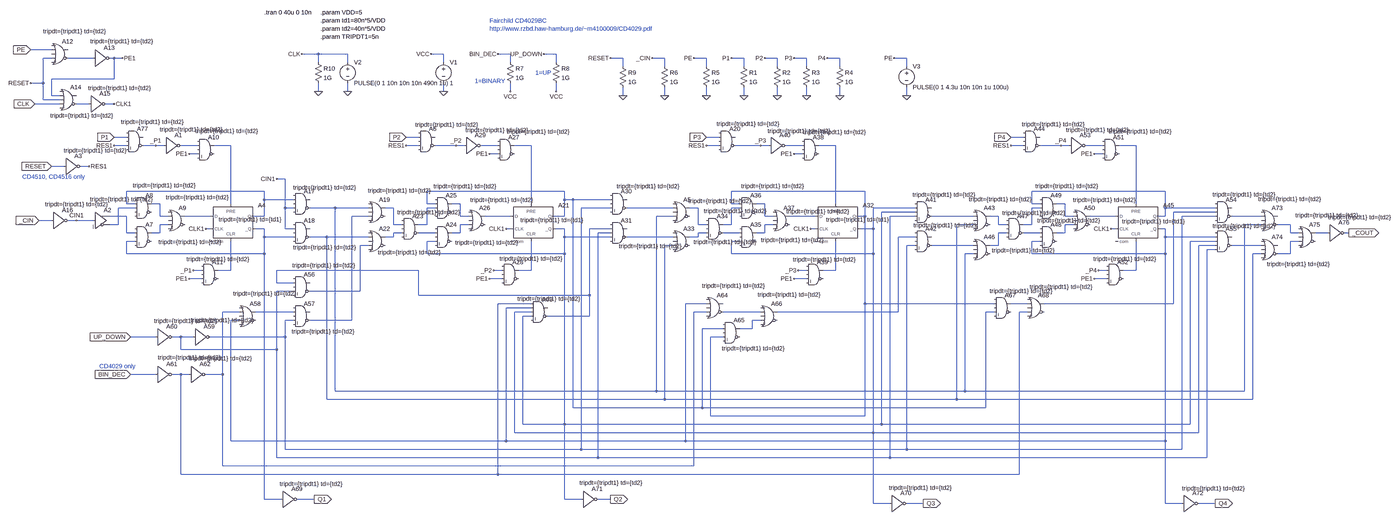
[diagram p0: schematic CD4029B_Hier_Tst_solo.asc, whole sheet]
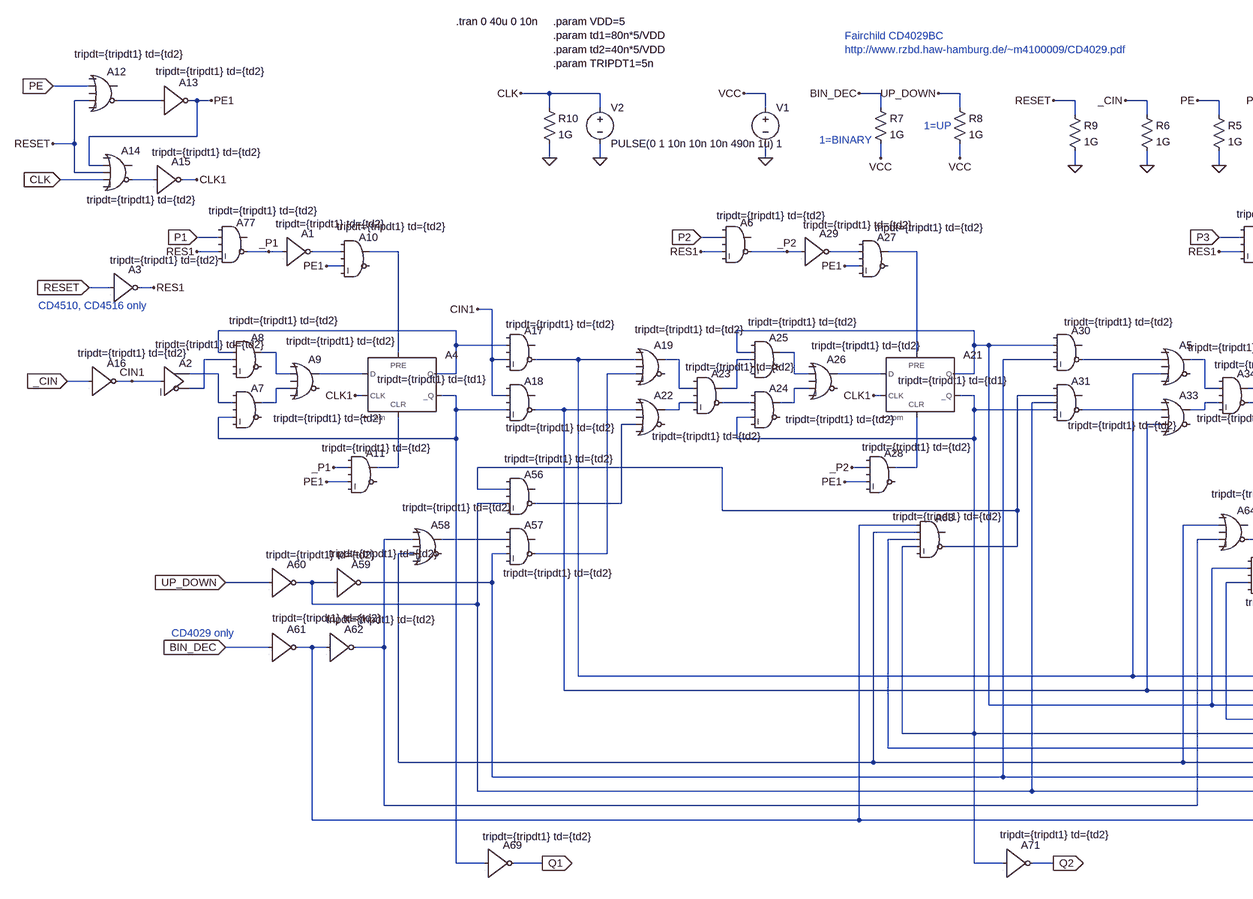
[diagram p1: schematic CD4029B_Hier_Tst_solo.asc, part, row 1 of 1, column 1 of 2]
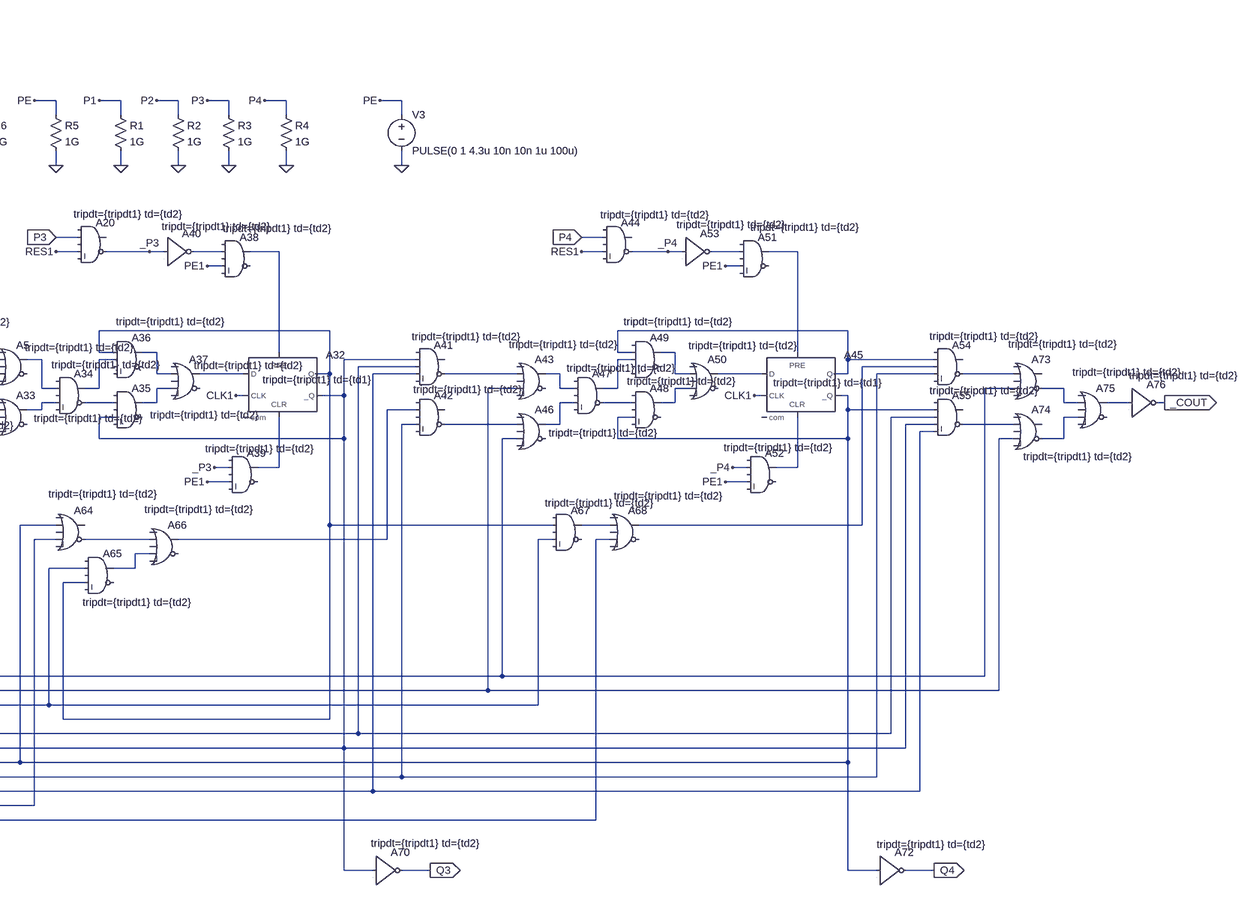
[diagram p2: schematic CD4029B_Hier_Tst_solo.asc, part, row 1 of 1, column 2 of 2]
CD4029B_Hier_Tst_solo.asc, the LTspice schematic file:
Version 4
SHEET 1 5108 1400
WIRE -64 -416 -144 -416
WIRE 960 -400 896 -400
WIRE 1072 -400 960 -400
WIRE 1440 -400 1392 -400
WIRE 1696 -400 1648 -400
WIRE 1872 -400 1824 -400
WIRE -64 -384 -96 -384
WIRE 96 -384 0 -384
WIRE 176 -384 160 -384
WIRE 208 -384 176 -384
WIRE 2128 -384 2080 -384
WIRE 2288 -384 2240 -384
WIRE 2448 -384 2400 -384
WIRE 2592 -384 2544 -384
WIRE 2720 -384 2672 -384
WIRE 2832 -384 2784 -384
WIRE 2960 -384 2912 -384
WIRE 3216 -384 3168 -384
WIRE 960 -368 960 -400
WIRE 1072 -368 1072 -400
WIRE 1440 -368 1440 -400
WIRE 1696 -368 1696 -400
WIRE 1872 -368 1872 -400
WIRE 2128 -352 2128 -384
WIRE 2288 -352 2288 -384
WIRE 2448 -352 2448 -384
WIRE 2592 -352 2592 -384
WIRE 2720 -352 2720 -384
WIRE 2832 -352 2832 -384
WIRE 2960 -352 2960 -384
WIRE 3216 -352 3216 -384
WIRE 176 -304 176 -384
WIRE 176 -304 -64 -304
WIRE -96 -288 -96 -384
WIRE -96 -288 -144 -288
WIRE 960 -256 960 -288
WIRE 1072 -256 1072 -288
WIRE 1440 -256 1440 -288
WIRE 1696 -256 1696 -288
WIRE 1872 -256 1872 -288
WIRE -64 -240 -64 -304
WIRE -32 -240 -64 -240
WIRE 2128 -240 2128 -272
WIRE 2288 -240 2288 -272
WIRE 2448 -240 2448 -272
WIRE 2592 -240 2592 -272
WIRE 2720 -240 2720 -272
WIRE 2832 -240 2832 -272
WIRE 2960 -240 2960 -272
WIRE 3216 -240 3216 -272
WIRE -96 -224 -96 -288
WIRE -32 -224 -96 -224
WIRE -32 -208 -128 -208
WIRE 80 -208 32 -208
WIRE 176 -208 144 -208
WIRE 224 -80 176 -80
WIRE 1344 -80 1296 -80
WIRE 2496 -80 2448 -80
WIRE 3664 -80 3616 -80
WIRE 224 -48 176 -48
WIRE 336 -48 288 -48
WIRE 368 -48 336 -48
WIRE 496 -48 432 -48
WIRE 624 -48 560 -48
WIRE 1344 -48 1296 -48
WIRE 1488 -48 1408 -48
WIRE 1520 -48 1488 -48
WIRE 1648 -48 1584 -48
WIRE 1776 -48 1712 -48
WIRE 2496 -48 2448 -48
WIRE 2656 -48 2560 -48
WIRE 2688 -48 2656 -48
WIRE 2816 -48 2752 -48
WIRE 2944 -48 2880 -48
WIRE 3664 -48 3616 -48
WIRE 3808 -48 3728 -48
WIRE 3840 -48 3808 -48
WIRE 3968 -48 3904 -48
WIRE 4096 -48 4032 -48
WIRE 496 -16 464 -16
WIRE 1648 -16 1616 -16
WIRE 2816 -16 2784 -16
WIRE 3968 -16 3936 -16
WIRE -16 32 -64 32
WIRE 80 32 48 32
WIRE 832 80 800 80
WIRE 752 128 224 128
WIRE 1904 128 1376 128
WIRE 3056 128 2544 128
WIRE 4208 128 3696 128
WIRE 752 160 752 128
WIRE 864 160 752 160
WIRE 1904 160 1904 128
WIRE 1936 160 1904 160
WIRE 2080 160 1936 160
WIRE 224 176 224 128
WIRE 256 176 224 176
WIRE 352 176 320 176
WIRE 624 176 624 -48
WIRE 1376 176 1376 128
WIRE 1408 176 1376 176
WIRE 1504 176 1472 176
WIRE 1776 176 1776 -48
WIRE 2544 176 2544 128
WIRE 2576 176 2544 176
WIRE 2672 176 2640 176
WIRE 2944 176 2944 -48
WIRE 3696 176 3696 128
WIRE 3728 176 3696 176
WIRE 3824 176 3792 176
WIRE 4096 176 4096 -48
WIRE 256 192 192 192
WIRE 832 192 832 80
WIRE 864 192 832 192
WIRE 1024 192 928 192
WIRE 1152 192 1024 192
WIRE 1248 192 1216 192
WIRE 1408 192 1376 192
WIRE 2080 192 1968 192
WIRE 2320 192 2144 192
WIRE 2416 192 2384 192
WIRE 2576 192 2544 192
WIRE 3248 192 3088 192
WIRE 3728 192 3696 192
WIRE 4208 192 4208 128
WIRE 4400 192 4208 192
WIRE 3248 208 3120 208
WIRE 4400 208 4240 208
WIRE 224 224 160 224
WIRE 352 224 352 176
WIRE 384 224 352 224
WIRE 544 224 448 224
WIRE 752 224 752 160
WIRE 752 224 704 224
WIRE 1152 224 1088 224
WIRE 1504 224 1504 176
WIRE 1536 224 1504 224
WIRE 1696 224 1600 224
WIRE 1904 224 1904 160
WIRE 1904 224 1856 224
WIRE 2320 224 2256 224
WIRE 2672 224 2672 176
WIRE 2704 224 2672 224
WIRE 2864 224 2768 224
WIRE 3056 224 3056 128
WIRE 3056 224 3024 224
WIRE 3248 224 3152 224
WIRE 3472 224 3312 224
WIRE 3568 224 3536 224
WIRE 3824 224 3824 176
WIRE 3856 224 3824 224
WIRE 4016 224 3920 224
WIRE 4208 224 4208 192
WIRE 4208 224 4176 224
WIRE 4400 224 4272 224
WIRE 4576 224 4464 224
WIRE -64 240 -112 240
WIRE 32 240 0 240
WIRE 96 240 32 240
WIRE 192 256 192 192
WIRE 192 256 160 256
WIRE 384 256 352 256
WIRE 1248 256 1248 192
WIRE 1280 256 1248 256
WIRE 1376 256 1376 192
WIRE 1376 256 1344 256
WIRE 1536 256 1504 256
WIRE 2416 256 2416 192
WIRE 2448 256 2416 256
WIRE 2544 256 2544 192
WIRE 2544 256 2512 256
WIRE 2704 256 2672 256
WIRE 3472 256 3408 256
WIRE 3568 256 3568 224
WIRE 3600 256 3568 256
WIRE 3696 256 3696 192
WIRE 3696 256 3664 256
WIRE 3856 256 3824 256
WIRE 4576 256 4512 256
WIRE 4688 256 4640 256
WIRE 544 272 528 272
WIRE 752 272 720 272
WIRE 832 272 832 192
WIRE 864 272 832 272
WIRE 1696 272 1680 272
WIRE 1904 272 1872 272
WIRE 2080 272 2000 272
WIRE 2864 272 2848 272
WIRE 3088 272 3088 192
WIRE 3088 272 3040 272
WIRE 4016 272 4000 272
WIRE 4208 272 4192 272
WIRE 224 288 224 224
WIRE 256 288 224 288
WIRE 352 288 352 256
WIRE 352 288 320 288
WIRE 1280 288 1248 288
WIRE 1408 288 1344 288
WIRE 1504 288 1504 256
WIRE 1504 288 1472 288
WIRE 2080 288 2032 288
WIRE 2448 288 2416 288
WIRE 2576 288 2512 288
WIRE 2672 288 2672 256
WIRE 2672 288 2640 288
WIRE 3600 288 3568 288
WIRE 3728 288 3664 288
WIRE 3824 288 3824 256
WIRE 3824 288 3792 288
WIRE 4688 288 4688 256
WIRE 4720 288 4688 288
WIRE 4832 288 4784 288
WIRE 4912 288 4896 288
WIRE 752 304 752 272
WIRE 864 304 752 304
WIRE 992 304 928 304
WIRE 1152 304 992 304
WIRE 1248 304 1248 288
WIRE 1248 304 1216 304
WIRE 1904 304 1904 272
WIRE 2080 304 1904 304
WIRE 2320 304 2144 304
WIRE 2416 304 2416 288
WIRE 2416 304 2384 304
WIRE 3248 304 3184 304
WIRE 4208 304 4208 272
WIRE 4400 304 4208 304
WIRE 256 320 224 320
WIRE 1408 320 1376 320
WIRE 2576 320 2544 320
WIRE 3728 320 3696 320
WIRE 4400 320 4304 320
WIRE 4720 320 4688 320
WIRE 1152 336 1120 336
WIRE 2320 336 2288 336
WIRE 3248 336 3216 336
WIRE 3472 336 3312 336
WIRE 3568 336 3568 288
WIRE 3568 336 3536 336
WIRE 4400 336 4336 336
WIRE 4576 336 4464 336
WIRE 4400 352 4368 352
WIRE 224 368 224 320
WIRE 752 368 752 304
WIRE 752 368 224 368
WIRE 1376 368 1376 320
WIRE 1904 368 1904 304
WIRE 1904 368 1376 368
WIRE 2544 368 2544 320
WIRE 3088 368 3088 272
WIRE 3088 368 2544 368
WIRE 3472 368 3440 368
WIRE 3696 368 3696 320
WIRE 4208 368 4208 304
WIRE 4208 368 3696 368
WIRE 4576 368 4544 368
WIRE 4688 368 4688 320
WIRE 4688 368 4640 368
WIRE 512 432 480 432
WIRE 624 432 624 320
WIRE 624 432 576 432
WIRE 1344 432 800 432
WIRE 1664 432 1632 432
WIRE 1776 432 1776 320
WIRE 1776 432 1728 432
WIRE 2832 432 2800 432
WIRE 2944 432 2944 320
WIRE 2944 432 2896 432
WIRE 3984 432 3952 432
WIRE 4096 432 4096 320
WIRE 4096 432 4048 432
WIRE 512 464 464 464
WIRE 1664 464 1616 464
WIRE 2832 464 2784 464
WIRE 3984 464 3936 464
WIRE 800 480 800 432
WIRE 864 480 800 480
WIRE 864 512 800 512
WIRE 1120 512 1120 336
WIRE 1120 512 928 512
WIRE 1344 528 1344 432
WIRE 2000 528 2000 272
WIRE 2000 528 1344 528
WIRE 1776 560 1648 560
WIRE 2448 560 2368 560
WIRE 3056 560 3056 224
WIRE 3552 560 3056 560
WIRE 3680 560 3616 560
WIRE 4240 560 4240 208
WIRE 4240 560 3744 560
WIRE 1776 576 1680 576
WIRE 656 592 592 592
WIRE 864 592 720 592
WIRE 1776 592 1712 592
WIRE 2448 592 2400 592
WIRE 2656 592 2512 592
WIRE 3184 592 3184 304
WIRE 3184 592 2720 592
WIRE 3552 592 3520 592
WIRE 3680 592 3648 592
WIRE 1776 608 1744 608
WIRE 2000 608 2000 528
WIRE 2000 608 1840 608
WIRE 656 624 624 624
WIRE 864 624 832 624
WIRE 1088 624 1088 224
WIRE 1088 624 928 624
WIRE 2656 624 2624 624
WIRE 2512 656 2432 656
WIRE 2624 656 2624 624
WIRE 2624 656 2576 656
WIRE 336 688 240 688
WIRE 432 688 400 688
WIRE 480 688 432 688
WIRE 832 688 832 624
WIRE 832 688 544 688
WIRE 2512 688 2464 688
WIRE 432 736 432 688
WIRE 800 736 800 512
WIRE 800 736 432 736
WIRE 336 832 240 832
WIRE 432 832 400 832
WIRE 464 832 432 832
WIRE 592 832 592 592
WIRE 592 832 528 832
WIRE 1024 896 1024 192
WIRE 2256 896 2256 224
WIRE 2256 896 1024 896
WIRE 3440 896 3440 368
WIRE 3440 896 2256 896
WIRE 4512 896 4512 256
WIRE 4512 896 3440 896
WIRE 992 928 992 304
WIRE 2288 928 2288 336
WIRE 2288 928 992 928
WIRE 3408 928 3408 256
WIRE 3408 928 2288 928
WIRE 4544 928 4544 368
WIRE 4544 928 3408 928
WIRE 1936 960 1936 160
WIRE 2432 960 2432 656
WIRE 2432 960 1936 960
WIRE 3520 960 3520 592
WIRE 3520 960 2432 960
WIRE 2464 992 2464 688
WIRE 3056 992 3056 560
WIRE 3056 992 2464 992
WIRE 1744 1024 1744 608
WIRE 1904 1024 1904 368
WIRE 1904 1024 1744 1024
WIRE 3120 1024 3120 208
WIRE 3120 1024 1904 1024
WIRE 4304 1024 4304 320
WIRE 4304 1024 3120 1024
WIRE 1712 1056 1712 592
WIRE 3088 1056 3088 368
WIRE 3088 1056 1712 1056
WIRE 4336 1056 4336 336
WIRE 4336 1056 3088 1056
WIRE 624 1088 624 624
WIRE 1680 1088 1680 576
WIRE 1680 1088 624 1088
WIRE 2368 1088 2368 560
WIRE 2368 1088 1680 1088
WIRE 4208 1088 4208 368
WIRE 4208 1088 2368 1088
WIRE 832 1120 832 688
WIRE 1968 1120 1968 192
WIRE 1968 1120 832 1120
WIRE 3216 1120 3216 336
WIRE 3216 1120 1968 1120
WIRE 4272 1120 4272 224
WIRE 4272 1120 3216 1120
WIRE 800 1152 800 736
WIRE 2032 1152 2032 288
WIRE 2032 1152 800 1152
WIRE 3152 1152 3152 224
WIRE 3152 1152 2032 1152
WIRE 4368 1152 4368 352
WIRE 4368 1152 3152 1152
WIRE 592 1184 592 832
WIRE 2400 1184 2400 592
WIRE 2400 1184 592 1184
WIRE 432 1216 432 832
WIRE 1648 1216 1648 560
WIRE 1648 1216 432 1216
WIRE 3648 1216 3648 592
WIRE 3648 1216 1648 1216
WIRE 752 1312 752 368
WIRE 816 1312 752 1312
WIRE 944 1312 880 1312
WIRE 1904 1312 1904 1024
WIRE 1968 1312 1904 1312
WIRE 2080 1312 2032 1312
WIRE 3088 1328 3088 1056
WIRE 3152 1328 3088 1328
WIRE 3280 1328 3216 1328
WIRE 4208 1328 4208 1088
WIRE 4272 1328 4208 1328
WIRE 4400 1328 4336 1328
FLAG 176 -80 P1
IOPIN 176 -80 In
FLAG 336 -48 _P1
FLAG -144 -416 PE
IOPIN -144 -416 In
FLAG 464 -16 PE1
FLAG 464 464 PE1
FLAG 480 432 _P1
FLAG -128 -208 CLK
IOPIN -128 -208 In
FLAG 528 272 CLK1
FLAG 176 -208 CLK1
FLAG -112 240 _CIN
IOPIN -112 240 In
FLAG 32 240 CIN1
FLAG 800 80 CIN1
FLAG 1296 -80 P2
IOPIN 1296 -80 In
FLAG 1488 -48 _P2
FLAG 1616 -16 PE1
FLAG 1616 464 PE1
FLAG 1632 432 _P2
FLAG 1680 272 CLK1
FLAG 208 -384 PE1
FLAG 2448 -80 P3
IOPIN 2448 -80 In
FLAG 2656 -48 _P3
FLAG 2784 -16 PE1
FLAG 2784 464 PE1
FLAG 2800 432 _P3
FLAG 2848 272 CLK1
FLAG 3616 -80 P4
IOPIN 3616 -80 In
FLAG 3808 -48 _P4
FLAG 3936 -16 PE1
FLAG 3936 464 PE1
FLAG 3952 432 _P4
FLAG 4000 272 CLK1
FLAG 240 688 UP_DOWN
IOPIN 240 688 In
FLAG 240 832 BIN_DEC
IOPIN 240 832 In
FLAG 944 1312 Q1
IOPIN 944 1312 Out
FLAG 2080 1312 Q2
IOPIN 2080 1312 Out
FLAG 3280 1328 Q3
IOPIN 3280 1328 Out
FLAG 4400 1328 Q4
IOPIN 4400 1328 Out
FLAG 4912 288 _COUT
IOPIN 4912 288 Out
FLAG 2960 -240 0
FLAG 2832 -240 0
FLAG 2720 -240 0
FLAG 2592 -240 0
FLAG 2544 -384 P1
FLAG 2672 -384 P2
FLAG 2784 -384 P3
FLAG 2912 -384 P4
FLAG 2448 -240 0
FLAG 2400 -384 PE
FLAG 2288 -240 0
FLAG 2240 -384 _CIN
FLAG 1648 -400 BIN_DEC
FLAG 1392 -400 VCC
FLAG 1440 -256 0
FLAG 1072 -256 0
FLAG 896 -400 CLK
FLAG 1824 -400 UP_DOWN
FLAG 1696 -256 VCC
FLAG 1872 -256 VCC
FLAG 3216 -240 0
FLAG 3168 -384 PE
FLAG -144 -288 RESET
FLAG 80 32 RES1
FLAG -64 32 RESET
IOPIN -64 32 In
FLAG 176 -48 RES1
FLAG 1296 -48 RES1
FLAG 2448 -48 RES1
FLAG 3616 -48 RES1
FLAG 2128 -240 0
FLAG 2080 -384 RESET
FLAG 960 -256 0
SYMBOL Digital\\dflop 624 176 R0
WINDOW 123 -47 60 Left 0
SYMATTR Value2 tripdt={tripdt1} td={td1}
SYMATTR InstName A4
SYMBOL Digital\\and 288 240 R0
WINDOW 123 58 83 Left 0
SYMATTR Value2 tripdt={tripdt1} td={td2}
SYMATTR InstName A7
SYMBOL Digital\\and 288 128 R0
WINDOW 123 -40 -23 Left 0
SYMATTR Value2 tripdt={tripdt1} td={td2}
SYMATTR InstName A8
SYMBOL Digital\\or 416 176 R0
WINDOW 123 -41 -25 Left 0
SYMATTR Value2 tripdt={tripdt1} td={td2}
SYMATTR InstName A9
SYMBOL Digital\\and 528 -96 R0
WINDOW 123 -41 -8 Left 0
SYMATTR Value2 tripdt={tripdt1} td={td2}
SYMATTR InstName A10
SYMBOL Digital\\and 544 384 R0
WINDOW 123 -90 5 Left 0
SYMATTR Value2 tripdt={tripdt1} td={td2}
SYMATTR InstName A11
SYMBOL Digital\\inv 368 -112 R0
WINDOW 123 -17 2 Left 0
SYMATTR Value2 tripdt={tripdt1} td={td2}
SYMATTR InstName A1
SYMBOL Digital\\inv 96 -448 R0
WINDOW 123 -11 -1 Left 0
SYMATTR Value2 tripdt={tripdt1} td={td2}
SYMATTR InstName A13
SYMBOL Digital\\or 0 -288 R0
WINDOW 123 -69 125 Left 0
SYMATTR Value2 tripdt={tripdt1} td={td2}
SYMATTR InstName A14
SYMBOL Digital\\inv 80 -272 R0
WINDOW 123 -4 3 Left 0
SYMATTR Value2 tripdt={tripdt1} td={td2}
SYMATTR InstName A15
SYMBOL Digital\\inv -64 176 R0
WINDOW 123 -25 2 Left 0
SYMATTR Value2 tripdt={tripdt1} td={td2}
SYMATTR InstName A16
SYMBOL Digital\\and 896 112 R0
WINDOW 123 -33 2 Left 0
SYMATTR Value2 tripdt={tripdt1} td={td2}
SYMATTR InstName A17
SYMBOL Digital\\and 896 224 R0
WINDOW 123 -33 120 Left 0
SYMATTR Value2 tripdt={tripdt1} td={td2}
SYMATTR InstName A18
SYMBOL Digital\\or 1184 144 R0
WINDOW 123 -34 -19 Left 0
SYMATTR Value2 tripdt={tripdt1} td={td2}
SYMATTR InstName A19
SYMBOL Digital\\dflop 1776 176 R0
WINDOW 123 -41 63 Left 0
SYMATTR Value2 tripdt={tripdt1} td={td1}
SYMATTR InstName A21
SYMBOL Digital\\or 1184 256 R0
WINDOW 123 4 107 Left 0
SYMATTR Value2 tripdt={tripdt1} td={td2}
SYMATTR InstName A22
SYMBOL Digital\\and 1312 208 R0
WINDOW 123 -50 1 Left 0
SYMATTR Value2 tripdt={tripdt1} td={td2}
SYMATTR InstName A23
SYMBOL Digital\\and 1440 240 R0
WINDOW 123 45 85 Left 0
SYMATTR Value2 tripdt={tripdt1} td={td2}
SYMATTR InstName A24
SYMBOL Digital\\and 1440 128 R0
WINDOW 123 -39 -19 Left 0
SYMATTR Value2 tripdt={tripdt1} td={td2}
SYMATTR InstName A25
SYMBOL Digital\\or 1568 176 R0
WINDOW 123 -26 -15 Left 0
SYMATTR Value2 tripdt={tripdt1} td={td2}
SYMATTR InstName A26
SYMBOL Digital\\and 1680 -96 R0
WINDOW 123 2 -5 Left 0
SYMATTR Value2 tripdt={tripdt1} td={td2}
SYMATTR InstName A27
SYMBOL Digital\\and 1696 384 R0
WINDOW 123 -41 3 Left 0
SYMATTR Value2 tripdt={tripdt1} td={td2}
SYMATTR InstName A28
SYMBOL Digital\\inv 1520 -112 R0
WINDOW 123 4 5 Left 0
SYMATTR Value2 tripdt={tripdt1} td={td2}
SYMATTR InstName A29
SYMBOL Digital\\and 2112 112 R0
WINDOW 123 -8 -3 Left 0
SYMATTR Value2 tripdt={tripdt1} td={td2}
SYMATTR InstName A30
SYMBOL Digital\\and 2112 224 R0
WINDOW 123 0 115 Left 0
SYMATTR Value2 tripdt={tripdt1} td={td2}
SYMATTR InstName A31
SYMBOL Digital\\buf 96 176 R0
WINDOW 123 -12 -17 Left 0
SYMATTR Value2 tripdt={tripdt1} td={td2}
SYMATTR InstName A2
SYMBOL Digital\\or 2352 144 R0
WINDOW 123 27 21 Left 0
SYMATTR Value2 tripdt={tripdt1} td={td2}
SYMATTR InstName A5
SYMBOL Digital\\dflop 2944 176 R0
WINDOW 123 -37 61 Left 0
SYMATTR Value2 tripdt={tripdt1} td={td1}
SYMATTR InstName A32
SYMBOL Digital\\or 2352 256 R0
WINDOW 123 47 67 Left 0
SYMATTR Value2 tripdt={tripdt1} td={td2}
SYMATTR InstName A33
SYMBOL Digital\\and 2480 208 R0
WINDOW 123 -42 -4 Left 0
SYMATTR Value2 tripdt={tripdt1} td={td2}
SYMATTR InstName A34
SYMBOL Digital\\and 2608 240 R0
WINDOW 123 49 75 Left 0
SYMATTR Value2 tripdt={tripdt1} td={td2}
SYMATTR InstName A35
SYMBOL Digital\\and 2608 128 R0
WINDOW 123 -27 -20 Left 0
SYMATTR Value2 tripdt={tripdt1} td={td2}
SYMATTR InstName A36
SYMBOL Digital\\or 2736 176 R0
WINDOW 123 19 29 Left 0
SYMATTR Value2 tripdt={tripdt1} td={td2}
SYMATTR InstName A37
SYMBOL Digital\\and 2848 -96 R0
WINDOW 123 -29 -4 Left 0
SYMATTR Value2 tripdt={tripdt1} td={td2}
SYMATTR InstName A38
SYMBOL Digital\\and 2864 384 R0
WINDOW 123 -84 6 Left 0
SYMATTR Value2 tripdt={tripdt1} td={td2}
SYMATTR InstName A39
SYMBOL Digital\\inv 2688 -112 R0
WINDOW 123 -5 8 Left 0
SYMATTR Value2 tripdt={tripdt1} td={td2}
SYMATTR InstName A40
SYMBOL Digital\\and 3280 144 R0
WINDOW 123 -41 -3 Left 0
SYMATTR Value2 tripdt={tripdt1} td={td2}
SYMATTR InstName A41
SYMBOL Digital\\and 3280 256 R0
WINDOW 123 -38 3 Left 0
SYMATTR Value2 tripdt={tripdt1} td={td2}
SYMATTR InstName A42
SYMBOL Digital\\or 3504 176 R0
WINDOW 123 -49 -17 Left 0
SYMATTR Value2 tripdt={tripdt1} td={td2}
SYMATTR InstName A43
SYMBOL Digital\\dflop 4096 176 R0
WINDOW 123 -54 68 Left 0
SYMATTR Value2 tripdt={tripdt1} td={td1}
SYMATTR InstName A45
SYMBOL Digital\\or 3504 288 R0
WINDOW 123 39 67 Left 0
SYMATTR Value2 tripdt={tripdt1} td={td2}
SYMATTR InstName A46
SYMBOL Digital\\and 3632 208 R0
WINDOW 123 -49 3 Left 0
SYMATTR Value2 tripdt={tripdt1} td={td2}
SYMATTR InstName A47
SYMBOL Digital\\and 3760 240 R0
WINDOW 123 -43 0 Left 0
SYMATTR Value2 tripdt={tripdt1} td={td2}
SYMATTR InstName A48
SYMBOL Digital\\and 3760 128 R0
WINDOW 123 -50 -20 Left 0
SYMATTR Value2 tripdt={tripdt1} td={td2}
SYMATTR InstName A49
SYMBOL Digital\\or 3888 176 R0
WINDOW 123 -34 -15 Left 0
SYMATTR Value2 tripdt={tripdt1} td={td2}
SYMATTR InstName A50
SYMBOL Digital\\and 4000 -96 R0
WINDOW 123 -9 -6 Left 0
SYMATTR Value2 tripdt={tripdt1} td={td2}
SYMATTR InstName A51
SYMBOL Digital\\and 4016 384 R0
WINDOW 123 -84 4 Left 0
SYMATTR Value2 tripdt={tripdt1} td={td2}
SYMATTR InstName A52
SYMBOL Digital\\inv 3840 -112 R0
WINDOW 123 -13 4 Left 0
SYMATTR Value2 tripdt={tripdt1} td={td2}
SYMATTR InstName A53
SYMBOL Digital\\and 4432 144 R0
WINDOW 123 -42 -4 Left 0
SYMATTR Value2 tripdt={tripdt1} td={td2}
SYMATTR InstName A54
SYMBOL Digital\\and 4432 256 R0
WINDOW 123 -42 5 Left 0
SYMATTR Value2 tripdt={tripdt1} td={td2}
SYMATTR InstName A55
SYMBOL Digital\\and 896 432 R0
WINDOW 123 -36 -19 Left 0
SYMATTR Value2 tripdt={tripdt1} td={td2}
SYMATTR InstName A56
SYMBOL Digital\\and 896 544 R0
WINDOW 123 -39 123 Left 0
SYMATTR Value2 tripdt={tripdt1} td={td2}
SYMATTR InstName A57
SYMBOL Digital\\or 688 544 R0
WINDOW 123 -55 -23 Left 0
SYMATTR Value2 tripdt={tripdt1} td={td2}
SYMATTR InstName A58
SYMBOL Digital\\inv 480 624 R0
WINDOW 123 -10 0 Left 0
SYMATTR Value2 tripdt={tripdt1} td={td2}
SYMATTR InstName A59
SYMBOL Digital\\inv 336 624 R0
WINDOW 123 -6 2 Left 0
SYMATTR Value2 tripdt={tripdt1} td={td2}
SYMATTR InstName A60
SYMBOL Digital\\inv 336 768 R0
WINDOW 123 8 -1 Left 0
SYMATTR Value2 tripdt={tripdt1} td={td2}
SYMATTR InstName A61
SYMBOL Digital\\inv 464 768 R0
WINDOW 123 0 2 Left 0
SYMATTR Value2 tripdt={tripdt1} td={td2}
SYMATTR InstName A62
SYMBOL Digital\\and 1808 528 R0
WINDOW 123 -85 13 Left 0
SYMATTR Value2 tripdt={tripdt1} td={td2}
SYMATTR InstName A63
SYMBOL Digital\\or 2480 512 R0
WINDOW 123 -49 -21 Left 0
SYMATTR Value2 tripdt={tripdt1} td={td2}
SYMATTR InstName A64
SYMBOL Digital\\and 2544 608 R0
WINDOW 123 -37 124 Left 0
SYMATTR Value2 tripdt={tripdt1} td={td2}
SYMATTR InstName A65
SYMBOL Digital\\or 2688 544 R0
WINDOW 123 -43 -19 Left 0
SYMATTR Value2 tripdt={tripdt1} td={td2}
SYMATTR InstName A66
SYMBOL Digital\\and 3584 512 R0
WINDOW 123 -49 -1 Left 0
SYMATTR Value2 tripdt={tripdt1} td={td2}
SYMATTR InstName A67
SYMBOL Digital\\or 3712 512 R0
WINDOW 123 -24 -17 Left 0
SYMATTR Value2 tripdt={tripdt1} td={td2}
SYMATTR InstName A68
SYMBOL Digital\\inv 816 1248 R0
WINDOW 123 -5 5 Left 0
SYMATTR Value2 tripdt={tripdt1} td={td2}
SYMATTR InstName A69
SYMBOL Digital\\inv 3152 1264 R0
WINDOW 123 -4 4 Left 0
SYMATTR Value2 tripdt={tripdt1} td={td2}
SYMATTR InstName A70
SYMBOL Digital\\inv 1968 1248 R0
WINDOW 123 -7 1 Left 0
SYMATTR Value2 tripdt={tripdt1} td={td2}
SYMATTR InstName A71
SYMBOL Digital\\inv 4272 1264 R0
WINDOW 123 0 6 Left 0
SYMATTR Value2 tripdt={tripdt1} td={td2}
SYMATTR InstName A72
SYMBOL Digital\\or 4608 176 R0
WINDOW 123 -43 -18 Left 0
SYMATTR Value2 tripdt={tripdt1} td={td2}
SYMATTR InstName A73
SYMBOL Digital\\or 4608 288 R0
WINDOW 123 -10 120 Left 0
SYMATTR Value2 tripdt={tripdt1} td={td2}
SYMATTR InstName A74
SYMBOL Digital\\or 4752 240 R0
WINDOW 123 -45 -20 Left 0
SYMATTR Value2 tripdt={tripdt1} td={td2}
SYMATTR InstName A75
SYMBOL Digital\\inv 4832 224 R0
WINDOW 123 1 4 Left 0
SYMATTR Value2 tripdt={tripdt1} td={td2}
SYMATTR InstName A76
SYMBOL res 2576 -368 R0
SYMATTR InstName R1
SYMATTR Value 1G
SYMBOL res 2704 -368 R0
SYMATTR InstName R2
SYMATTR Value 1G
SYMBOL res 2816 -368 R0
SYMATTR InstName R3
SYMATTR Value 1G
SYMBOL res 2944 -368 R0
SYMATTR InstName R4
SYMATTR Value 1G
SYMBOL res 2432 -368 R0
SYMATTR InstName R5
SYMATTR Value 1G
SYMBOL res 2272 -368 R0
SYMATTR InstName R6
SYMATTR Value 1G
SYMBOL res 1680 -384 R0
SYMATTR InstName R7
SYMATTR Value 1G
SYMBOL voltage 1440 -384 R0
SYMATTR InstName V1
SYMATTR Value 1
SYMBOL voltage 1072 -384 R0
WINDOW 123 0 0 Left 0
WINDOW 39 0 0 Left 0
SYMATTR InstName V2
SYMATTR Value PULSE(0 1 10n 10n 10n 490n 1u)
SYMBOL res 1856 -384 R0
SYMATTR InstName R8
SYMATTR Value 1G
SYMBOL voltage 3216 -368 R0
WINDOW 123 0 0 Left 0
WINDOW 39 0 0 Left 0
SYMATTR InstName V3
SYMATTR Value PULSE(0 1 4.3u 10n 10n 1u 100u)
SYMBOL Digital\\or -32 -464 R0
WINDOW 123 -64 -23 Left 0
SYMATTR Value2 tripdt={tripdt1} td={td2}
SYMATTR InstName A12
SYMBOL Digital\\inv -16 -32 R0
WINDOW 123 -1 3 Left 0
SYMATTR Value2 tripdt={tripdt1} td={td2}
SYMATTR InstName A3
SYMBOL Digital\\and 1376 -128 R0
WINDOW 123 -45 0 Left 0
SYMATTR Value2 tripdt={tripdt1} td={td2}
SYMATTR InstName A6
SYMBOL Digital\\and 2528 -128 R0
WINDOW 123 -41 -3 Left 0
SYMATTR Value2 tripdt={tripdt1} td={td2}
SYMATTR InstName A20
SYMBOL Digital\\and 3696 -128 R0
WINDOW 123 -38 -2 Left 0
SYMATTR Value2 tripdt={tripdt1} td={td2}
SYMATTR InstName A44
SYMBOL Digital\\and 256 -128 R0
WINDOW 123 -54 -11 Left 0
SYMATTR Value2 tripdt={tripdt1} td={td2}
SYMATTR InstName A77
SYMBOL res 2112 -368 R0
SYMATTR InstName R9
SYMATTR Value 1G
SYMBOL res 944 -384 R0
SYMATTR InstName R10
SYMATTR Value 1G
TEXT 968 -560 Left 0 !.param VDD=5\n.param td1=80n*5/VDD \n.param td2=40n*5/VDD\n.param TRIPDT1=5n
TEXT 752 -560 Left 0 !.tran 0 40u 0 10n
TEXT 1616 -528 Left 0 ;Fairchild CD4029BC\nhttp://www.rzbd.haw-hamburg.de/~m4100009/CD4029.pdf
TEXT -176 72 Left 0 ;CD4510, CD4516 only
TEXT 1560 -296 Left 0 ;1=BINARY
TEXT 1792 -328 Left 0 ;1=UP
TEXT 120 800 Left 0 ;CD4029 only

The netlist it stands for:
* CD4029B_Hier_Tst_solo.asc
A4 N032 0 CLK1 N004 N063 N047 N011 0 DFLOP tripdt={tripdt1} td={td1}
A7 0 N031 0 N047 0 0 N041 0 AND tripdt={tripdt1} td={td2}
A8 0 N011 N019 0 0 0 N015 0 AND tripdt={tripdt1} td={td2}
A9 0 N015 0 N041 0 0 N032 0 OR tripdt={tripdt1} td={td2}
A10 0 N003 0 PE1 0 0 N004 0 AND tripdt={tripdt1} td={td2}
A11 0 _P1 0 PE1 0 0 N063 0 AND tripdt={tripdt1} td={td2}
A1 _P1 0 0 0 0 N003 0 0 BUF tripdt={tripdt1} td={td2}
A13 N001 0 0 0 0 PE1 0 0 BUF tripdt={tripdt1} td={td2}
A14 0 PE1 RESET CLK 0 N002 0 0 OR tripdt={tripdt1} td={td2}
A15 N002 0 0 0 0 CLK1 0 0 BUF tripdt={tripdt1} td={td2}
A16 _CIN 0 0 0 0 CIN1 0 0 BUF tripdt={tripdt1} td={td2}
A17 0 N011 0 CIN1 0 N020 0 0 AND tripdt={tripdt1} td={td2}
A18 0 CIN1 0 N047 0 N044 0 0 AND tripdt={tripdt1} td={td2}
A19 0 N020 0 N033 0 0 N021 0 OR tripdt={tripdt1} td={td2}
A21 N034 0 CLK1 N006 N064 N029 N012 0 DFLOP tripdt={tripdt1} td={td1}
A22 0 N044 0 N060 0 0 N050 0 OR tripdt={tripdt1} td={td2}
A23 0 N021 0 N050 0 N051 N022 0 AND tripdt={tripdt1} td={td2}
A24 0 N051 0 N029 0 0 N042 0 AND tripdt={tripdt1} td={td2}
A25 0 N012 N022 0 0 0 N016 0 AND tripdt={tripdt1} td={td2}
A26 0 N016 0 N042 0 0 N034 0 OR tripdt={tripdt1} td={td2}
A27 0 N005 0 PE1 0 0 N006 0 AND tripdt={tripdt1} td={td2}
A28 0 _P2 0 PE1 0 0 N064 0 AND tripdt={tripdt1} td={td2}
A29 _P2 0 0 0 0 N005 0 0 BUF tripdt={tripdt1} td={td2}
A30 0 N012 0 N023 0 N024 0 0 AND tripdt={tripdt1} td={td2}
A31 0 N048 N036 N029 0 N057 0 0 AND tripdt={tripdt1} td={td2}
A2 CIN1 0 0 0 0 N019 N031 0 BUF tripdt={tripdt1} td={td2}
A5 0 N024 0 N020 0 0 N025 0 OR tripdt={tripdt1} td={td2}
A32 N035 0 CLK1 N008 N065 N027 N013 0 DFLOP tripdt={tripdt1} td={td1}
A33 0 N057 0 N044 0 0 N052 0 OR tripdt={tripdt1} td={td2}
A34 0 N025 0 N052 0 N053 N026 0 AND tripdt={tripdt1} td={td2}
A35 0 N053 0 N027 0 0 N043 0 AND tripdt={tripdt1} td={td2}
A36 0 N013 N026 0 0 0 N017 0 AND tripdt={tripdt1} td={td2}
A37 0 N017 0 N043 0 0 N035 0 OR tripdt={tripdt1} td={td2}
A38 0 N007 0 PE1 0 0 N008 0 AND tripdt={tripdt1} td={td2}
A39 0 _P3 0 PE1 0 0 N065 0 AND tripdt={tripdt1} td={td2}
A40 _P3 0 0 0 0 N007 0 0 BUF tripdt={tripdt1} td={td2}
A41 0 N027 N029 N036 0 N037 0 0 AND tripdt={tripdt1} td={td2}
A42 0 N058 0 N023 0 N061 0 0 AND tripdt={tripdt1} td={td2}
A43 0 N037 0 N044 0 0 N038 0 OR tripdt={tripdt1} td={td2}
A45 N039 0 CLK1 N010 N066 N049 N014 0 DFLOP tripdt={tripdt1} td={td1}
A46 0 N061 0 N020 0 0 N054 0 OR tripdt={tripdt1} td={td2}
A47 0 N038 0 N054 0 N055 N028 0 AND tripdt={tripdt1} td={td2}
A48 0 N055 0 N049 0 0 N045 0 AND tripdt={tripdt1} td={td2}
A49 0 N014 N028 0 0 0 N018 0 AND tripdt={tripdt1} td={td2}
A50 0 N018 0 N045 0 0 N039 0 OR tripdt={tripdt1} td={td2}
A51 0 N009 0 PE1 0 0 N010 0 AND tripdt={tripdt1} td={td2}
A52 0 _P4 0 PE1 0 0 N066 0 AND tripdt={tripdt1} td={td2}
A53 _P4 0 0 0 0 N009 0 0 BUF tripdt={tripdt1} td={td2}
A54 0 N014 N030 N023 0 N040 0 0 AND tripdt={tripdt1} td={td2}
A55 0 N049 N029 N027 N036 N062 0 0 AND tripdt={tripdt1} td={td2}
A56 0 N048 0 N036 0 N060 0 0 AND tripdt={tripdt1} td={td2}
A57 0 N070 0 N023 0 N033 0 0 AND tripdt={tripdt1} td={td2}
A58 0 N069 0 N049 0 0 N070 0 OR tripdt={tripdt1} td={td2}
A59 N036 0 0 0 0 N023 0 0 BUF tripdt={tripdt1} td={td2}
A60 UP_DOWN 0 0 0 0 N036 0 0 BUF tripdt={tripdt1} td={td2}
A61 BIN_DEC 0 0 0 0 N067 0 0 BUF tripdt={tripdt1} td={td2}
A62 N067 0 0 0 0 N069 0 0 BUF tripdt={tripdt1} td={td2}
A63 N067 N049 N027 N029 0 N048 0 0 AND tripdt={tripdt1} td={td2}
A64 0 N049 0 N069 0 N071 0 0 OR tripdt={tripdt1} td={td2}
A65 0 N012 0 N013 0 0 N072 0 AND tripdt={tripdt1} td={td2}
A66 0 N071 0 N072 0 0 N058 0 OR tripdt={tripdt1} td={td2}
A67 0 N013 0 N012 0 0 N068 0 AND tripdt={tripdt1} td={td2}
A68 0 N068 0 N067 0 0 N030 0 OR tripdt={tripdt1} td={td2}
A69 N047 0 0 0 0 Q1 0 0 BUF tripdt={tripdt1} td={td2}
A70 N027 0 0 0 0 Q3 0 0 BUF tripdt={tripdt1} td={td2}
A71 N029 0 0 0 0 Q2 0 0 BUF tripdt={tripdt1} td={td2}
A72 N049 0 0 0 0 Q4 0 0 BUF tripdt={tripdt1} td={td2}
A73 0 N040 0 N020 0 N046 0 0 OR tripdt={tripdt1} td={td2}
A74 0 N062 0 N044 0 N059 0 0 OR tripdt={tripdt1} td={td2}
A75 0 N046 0 N059 0 0 N056 0 OR tripdt={tripdt1} td={td2}
A76 N056 0 0 0 0 _COUT 0 0 BUF tripdt={tripdt1} td={td2}
R1 P1 0 1G
R2 P2 0 1G
R3 P3 0 1G
R4 P4 0 1G
R5 PE 0 1G
R6 _CIN 0 1G
R7 BIN_DEC VCC 1G
V1 VCC 0 1
V2 CLK 0 PULSE(0 1 10n 10n 10n 490n 1u)
R8 UP_DOWN VCC 1G
V3 PE 0 PULSE(0 1 4.3u 10n 10n 1u 100u)
A12 0 PE 0 RESET 0 N001 0 0 OR tripdt={tripdt1} td={td2}
A3 RESET 0 0 0 0 RES1 0 0 BUF tripdt={tripdt1} td={td2}
A6 0 P2 0 RES1 0 _P2 0 0 AND tripdt={tripdt1} td={td2}
A20 0 P3 0 RES1 0 _P3 0 0 AND tripdt={tripdt1} td={td2}
A44 0 P4 0 RES1 0 _P4 0 0 AND tripdt={tripdt1} td={td2}
A77 0 P1 0 RES1 0 _P1 0 0 AND tripdt={tripdt1} td={td2}
R9 RESET 0 1G
R10 CLK 0 1G
.param VDD=5
.param td1=80n*5/VDD
.param td2=40n*5/VDD
.param TRIPDT1=5n
.tran 0 40u 0 10n
* Fairchild CD4029BC
* http://www.rzbd.haw-hamburg.de/~m4100009/CD4029.pdf
* CD4510, CD4516 only
* 1=BINARY
* 1=UP
* CD4029 only
.backanno
.end